# Altium schematic sheet Misc_switches.SchDoc
size B; Author: AM; CompanyName: Expatria Technologies; DrawnBy: A.Marles; Engineer: AM; Organization: Expatria Technologies; DocumentNumber: 7; Revision: A1; SheetNumber: 7; SheetTotal: 14; PCB_Rev: A1
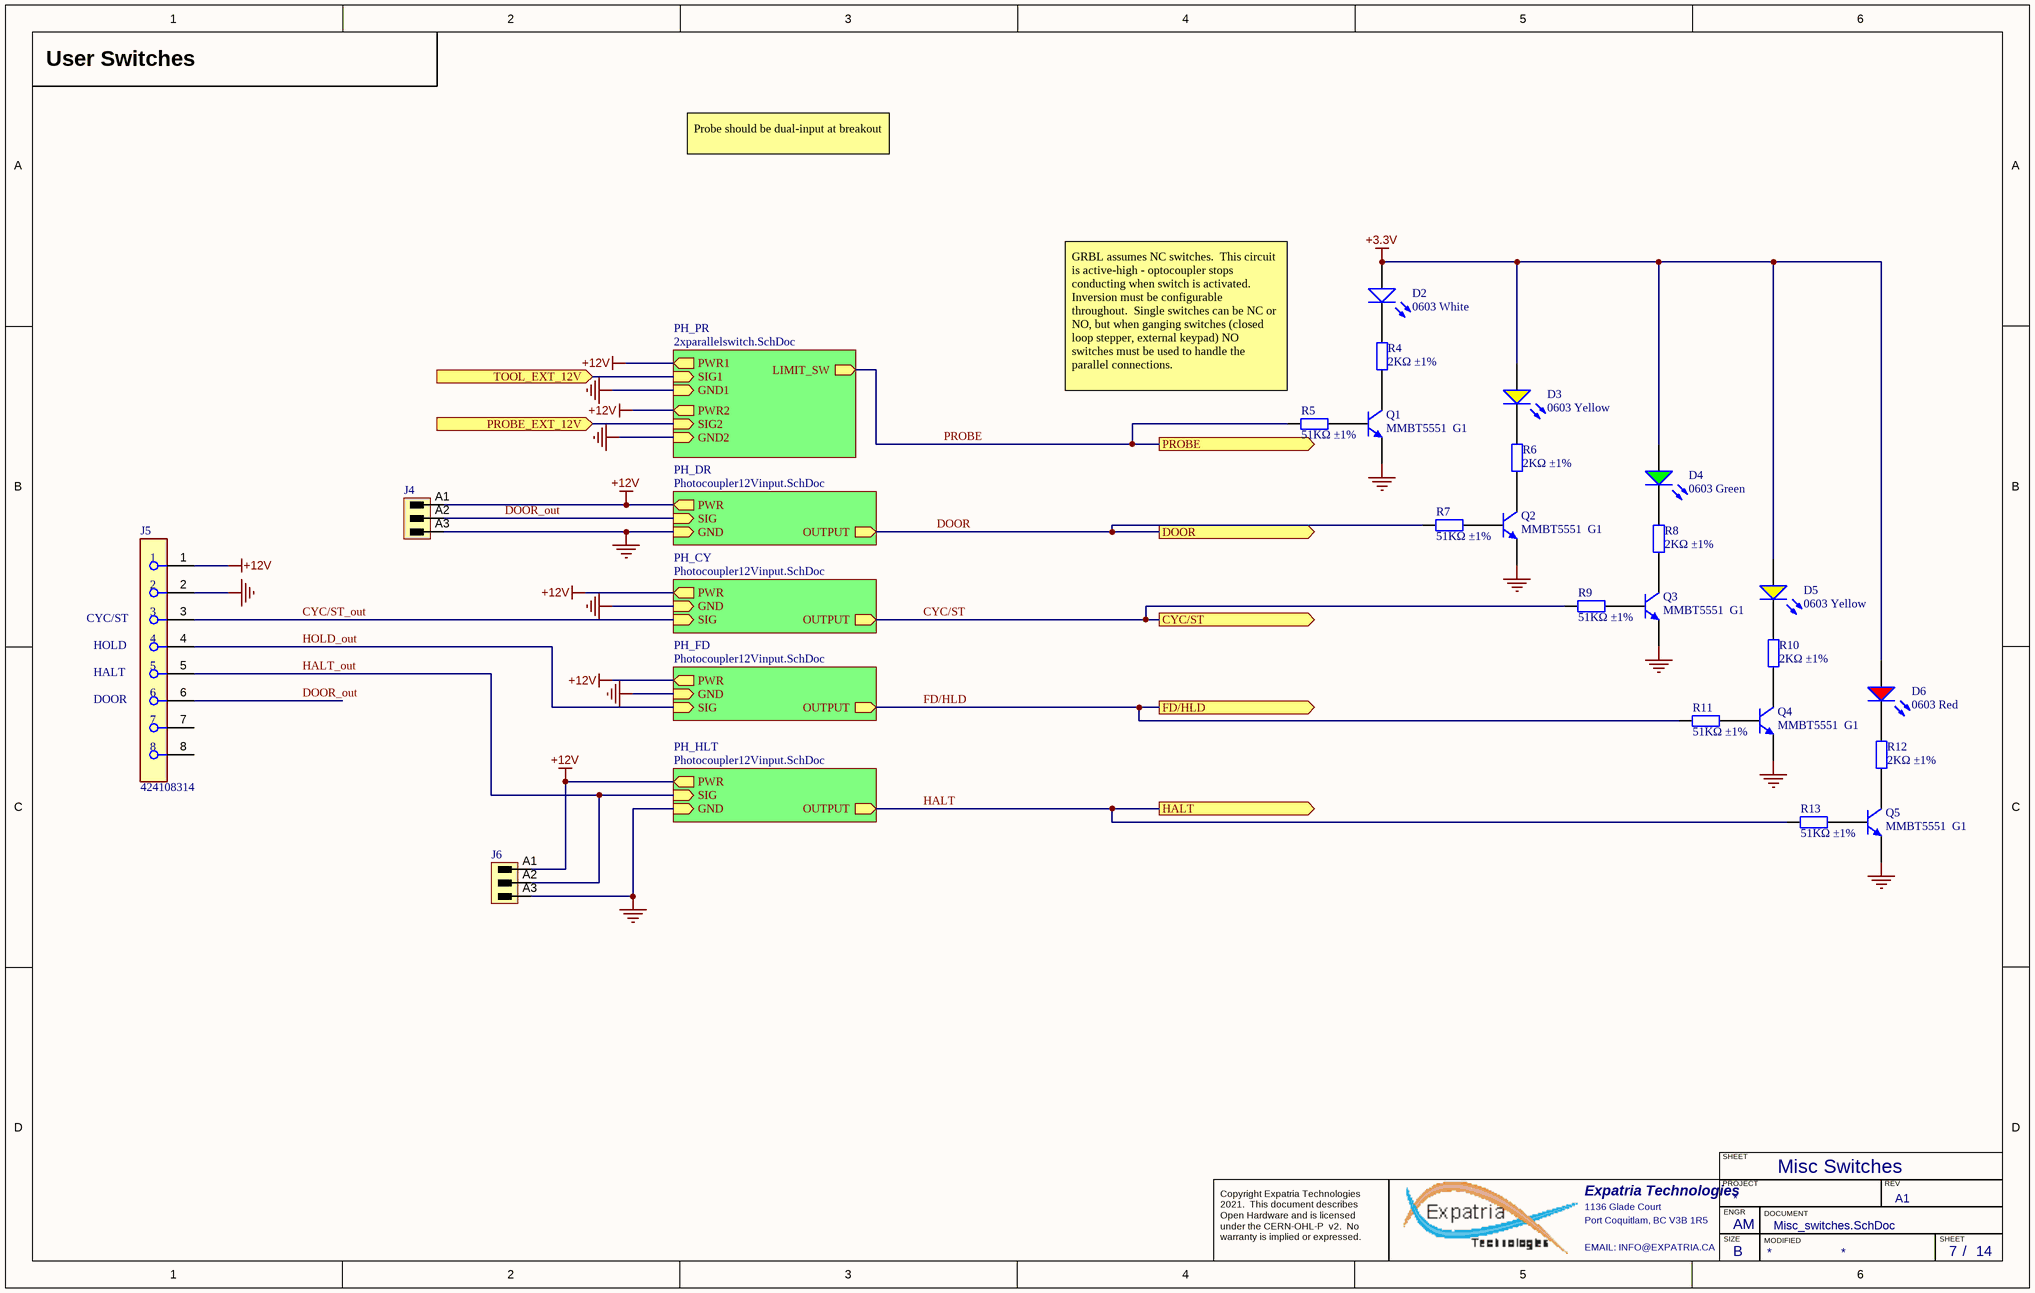
[diagram p0: Misc_switches.SchDoc]

## Parts
D2  0603 White  [0603_LED_S1]
D3  0603 Yellow  [0603_LED_S1]
D4  0603 Green  [0603_LED_S1]
D5  0603 Yellow  [0603_LED_S1]
D6  0603 Red  [0603_LED_S1]
J4  (no value)  [SL_3_50_180G_03]
J5  424108314  [FP-5555799-1-MFG]
J6  (no value)  [SL_3_50_180G_03]
Q1  MMBT5551  G1  [SOT-23(SOT-23-3)]
Q2  MMBT5551  G1  [SOT-23(SOT-23-3)]
Q3  MMBT5551  G1  [SOT-23(SOT-23-3)]
Q4  MMBT5551  G1  [SOT-23(SOT-23-3)]
Q5  MMBT5551  G1  [SOT-23(SOT-23-3)]
R4  2KΩ ±1%  [0402_R]
R5  51KΩ ±1%  [0402_R]
R6  2KΩ ±1%  [0402_R]
R7  51KΩ ±1%  [0402_R]
R8  2KΩ ±1%  [0402_R]
R9  51KΩ ±1%  [0402_R]
R10  2KΩ ±1%  [0402_R]
R11  51KΩ ±1%  [0402_R]
R12  2KΩ ±1%  [0402_R]
R13  51KΩ ±1%  [0402_R]

## Sub-sheets
PH_CY = Photocoupler12Vinput.SchDoc: OUTPUT (out), GND (in), SIG (in), PWR (out)
PH_DR = Photocoupler12Vinput.SchDoc: OUTPUT (out), PWR (out), SIG (in), GND (in)
PH_FD = Photocoupler12Vinput.SchDoc: OUTPUT (out), PWR (out), GND (in), SIG (in)
PH_HLT = Photocoupler12Vinput.SchDoc: OUTPUT (out), GND (in), PWR (out), SIG (in)
PH_PR = 2xparallelswitch.SchDoc: LIMIT_SW (out), GND1 (in), PWR2 (out), GND2 (in), SIG2 (in), SIG1 (in), PWR1 (out)

## Ports
CYC/ST (out), DOOR (out), FD/HLD (out), HALT (out), PROBE (out), PROBE_EXT_12V (in), TOOL_EXT_12V (in)

## Nets
+3.3V: D2.A D3.A D4.A D5.A D6.A
+12V: J4.A1 J5.1 J6.A1 ; sheet PH_DR/PWR, sheet PH_CY/PWR, sheet PH_FD/PWR, sheet PH_HLT/PWR, sheet PH_PR/PWR2, sheet PH_PR/PWR1
GND: J4.A3 J5.2 J6.A3 Q1.2(E) Q2.2(E) Q3.2(E) Q4.2(E) Q5.2(E) ; sheet PH_DR/GND, sheet PH_CY/GND, sheet PH_FD/GND, sheet PH_HLT/GND, sheet PH_PR/GND1, sheet PH_PR/GND2
CYC/ST: R9.1 ; port CYC/ST, sheet PH_CY/OUTPUT
CYC/ST_out: J5.3 ; sheet PH_CY/SIG
DOOR: R7.1 ; port DOOR, sheet PH_DR/OUTPUT
DOOR_out: J4.A2 J5.6 ; sheet PH_DR/SIG
FD/HLD: R11.1 ; port FD/HLD, sheet PH_FD/OUTPUT
HALT: R13.1 ; port HALT, sheet PH_HLT/OUTPUT
HALT_out: J5.5 J6.A2 ; sheet PH_HLT/SIG
HOLD_out: J5.4 ; sheet PH_FD/SIG
PROBE: R5.1 ; port PROBE, sheet PH_PR/LIMIT_SW
PROBE_EXT_12V: port PROBE_EXT_12V, sheet PH_PR/SIG2
TOOL_EXT_12V: port TOOL_EXT_12V, sheet PH_PR/SIG1
NetD2_K: D2.K R4.1
NetD3_K: D3.K R6.1
NetD4_K: D4.K R8.1
NetD5_K: D5.K R10.1
NetD6_K: D6.K R12.1
NetQ1_1: Q1.1(B) R5.2
NetQ1_3: Q1.3(C) R4.2
NetQ2_1: Q2.1(B) R7.2
NetQ2_3: Q2.3(C) R6.2
NetQ3_1: Q3.1(B) R9.2
NetQ3_3: Q3.3(C) R8.2
NetQ4_1: Q4.1(B) R11.2
NetQ4_3: Q4.3(C) R10.2
NetQ5_1: Q5.1(B) R13.2
NetQ5_3: Q5.3(C) R12.2

Not connected (* = marked no-connect by the designer): J5 7 8

## Notes on the sheet
- User Switches
- Probe should be dual-input at breakout
- (near R5) GRBL assumes NC switches.  This circuit is active-high - optocoupler stops conducting when switch is activated.  Inversion must be configurable throughout.  Single switches can be NC or NO, but when ganging switches (closed loop stepper, external keypad) NO switches must be used to handle the parallel connections.
- (near J5) CYC/ST
- (near J5) HOLD
- (near J5) HALT
- (near J5) DOOR
- Misc Switches
- SHEET
- Expatria Technologies
- 1136 Glade Court
- Port Coquitlam, BC V3B 1R5
- PROJECT
- SIZE
- ENGR
- MODIFIED
- DOCUMENT
- REV
- Copyright Expatria Technologies 2021.  This document describes Open Hardware and is licensed under the CERN-OHL-P  v2.  No warranty is implied or expressed.
- EMAIL: INFO@EXPATRIA.CA
- B
- /

## Library data of the parts
D2 = 0603 LED White: LED; Package: 0603; Supplier: LC; SuppliersPartNumber: C2290; Color: White
D3 D5 = 0603 LED Yellow: LED; Package: 0603; Supplier: LC; SuppliersPartNumber: C72038; Color: Yellow
D4 = 0603 LED Green: LED; Package: 0603; Supplier: LC; SuppliersPartNumber: C72043; Color: Green
D6 = 0603 LED Red: LED; Package: 0603; Supplier: LC; SuppliersPartNumber: C2286; Color: Red
J4 J6 = CMP-1559-00904-1: Header,Male Pin,Covered(4 Sided) 3 1 0.138"（3.50mm） 3 P=3.5mm Pluggable System Terminal Block RoHS; PartNumber: WJ15EDGVC-3.5-3P; Manufacturer: Ningbo Kangnex Elec; Pitch_mm: 3.5 mm; UL_94_flammability_rating: V-0; Side_termination_characteristic: closed side; Solder_pin_length_mm: 3.2 mm; Short_text_for_material: SL 3.50/03/180G 3.2SN OR BX; Pitch_inch: 0.138 inch; PackageReference: SL_3_50_180G_03; Packaging: Box; Revision: V1; SuppliersPartNumber: C192778
J5 = CMP-03371-000003-1: CONN MOD JACK 8P8C VERT UNSHLD; SuppliersPartNumber: C563815; Supplier: LCSC
Q1-Q5 = SOT-23 MMBT5551  G1: 三极管; Package: SOT-23; Supplier: LC; SuppliersPartNumber: C2145
R4 R6 R8 R10 R12 = 0402 2K (2001) 1%: Chip resistor; Manufacturer: Uniroyal Elec; PartNumber: 0402WGF2001TCE; Power: 1/16W; Package: 0402; Supplier: LC; SuppliersPartNumber: C4109; Resistance: 2KΩ; Tolerance: 1%
R5 R7 R9 R11 R13 = 0402 51K (5102) 1%: Chip resistor; Manufacturer: Uniroyal Elec; PartNumber: 0402WGF5102TCE; Power: 1/16W; Package: 0402; Supplier: LC; SuppliersPartNumber: C25794; Resistance: 51KΩ; Tolerance: 1%